# EAGLE schematic test_board (EAGLE 7.5.0)
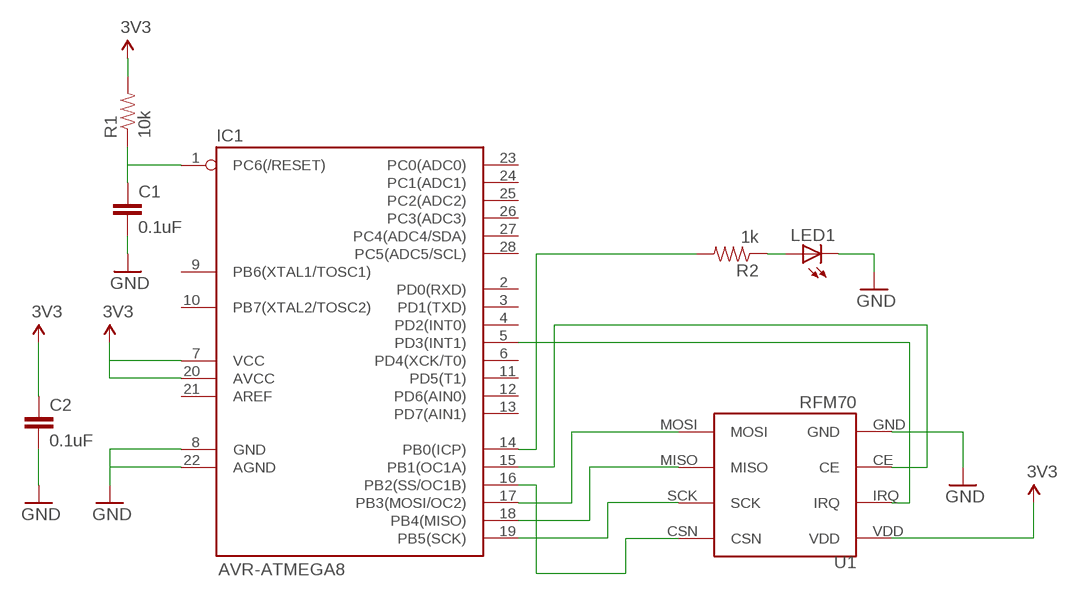
[diagram p0: schematic, sheet 1]

## Parts
C1  0.1uF  0.1UF-25V(+80/-20%)(0603)  [0603-CAP]
C2  0.1uF  0.1UF-25V(+80/-20%)(0603)  [0603-CAP]
IC1  AVR-ATMEGA8  AVR-MEGA8-PPTH  [DIL28-3]
LED1  LED5MM  [LED5MM]
R1  10k  0.75OHM-1/4W-1%(0805)  [0805]
R2  1k  0.75OHM-1/4W-1%(0805)  [0805]
U1  RFM70  [RFM70]

## Nets
GND: C1.2 C2.2 IC1.8(GND) IC1.22(AGND) LED1.K(C) U1.GND
N$1: IC1.17(PB3(MOSI/OC2)) U1.MOSI
N$2: IC1.18(PB4(MISO)) U1.MISO
N$3: IC1.19(PB5(SCK)) U1.SCK
N$4: IC1.15(PB1(OC1A)) U1.CE
N$5: IC1.16(PB2(SS/OC1B)) U1.CSN
N$6: IC1.5(PD3(INT1)) U1.IRQ
N$7: IC1.14(PB0(ICP)) R2.2
N$8: C1.1 IC1.1(PC6(/RESET)) R1.1
N$9: LED1.A R2.1
VCC: C2.1 IC1.7(VCC) IC1.20(AVCC) R1.2 U1.VDD ; supply symbol labelled 3V3
Unconnected: IC1.2(PD0(RXD)) IC1.3(PD1(TXD)) IC1.4(PD2(INT0)) IC1.6(PD4(XCK/T0)) IC1.9(PB6(XTAL1/TOSC1)) IC1.10(PB7(XTAL2/TOSC2)) IC1.11(PD5(T1)) IC1.12(PD6(AIN0)) IC1.13(PD7(AIN1)) IC1.21(AREF) IC1.23(PC0(ADC0)) IC1.24(PC1(ADC1)) IC1.25(PC2(ADC2)) IC1.26(PC3(ADC3)) IC1.27(PC4(ADC4/SDA)) IC1.28(PC5(ADC5/SCL))

## Library data of the parts
C1 C2 = SparkFun-Capacitors:0.1UF-25V(+80/-20%)(0603): CAP-00810 Ceramic Standard decoupling cap; PROD_ID: CAP-00810
IC1 = SparkFun-DigitalIC:AVR-MEGA8-P: MICROCONTROLLER 8 Kbytes FLASH 1 kbytes SRAM 512 bytes EEPROM USART 4-channel 10 bit ADC 2-channel 8 bit ADC
LED1 = adafruit:LED: LED OSRAM: - CHIPLED LG R971, LG N971, LY N971, LG Q971, LY Q971, LO R971, LY R971 LH N974, LH R974 LS Q976, LO Q976, LY Q976 LO Q996 - Hyper CHIPLED LW Q18S LB Q993, LB Q99A, LB R99A - SideLED LS A670, LO A670, LY A670, LG A670, LP A670 LB A673, LV A673, LT A673, LW A673 LH A674 LY A675 LS A676, LA A676, LO A676, LY A676, LW A676 LS A679, LY A679, LG A679 - Hyper Micro SIDELED® LS Y876, LA Y876, LO Y876, LY Y876 LT Y87S - SmartLED LW L88C, LW L88S LB L89C, LB L89S, LG L890 LS L89K, LO L89K, LY L89K LS L896, LA L896, LO L896, LY L896 - TOPLED LS T670, LO T670, LY T670, LG T670, LP T670 LSG T670, LSP T670, LSY T670, LOP T670, LYG T670 LG T671, LOG T671, LSG T671 LB T673, LV T673, LT T673, LW T673 LH T674 LS T676, LA T676, LO T676, LY T676, LB T676, LH T676, LSB T676, LW T676 LB T67C, LV T67C, LT T67C, LS T67K, LO T67K, LY T67K, LW E67C LS E67B, LA E67B, LO E67B, LY E67B, LB E67C, LV E67C, LT E67C LW T67C LS T679, LY T679, LG T679 LS T770, LO T770, LY T770, LG T770, LP T770 LB T773, LV T773, LT T773, LW T773 LH T774 LS E675, LA E675, LY E675, LS T675 LS T776, LA T776, LO T776, LY T776, LB T776 LHGB T686 LT T68C, LB T68C - Hyper Mini TOPLED® LB M676 - Mini TOPLED Santana® LG M470 LS M47K, LO M47K, LY M47K Source: http://www.osram.convergy.de/
R1 R2 = SparkFun-Resistors:0.75OHM-1/4W-1%(0805): RES-08474; PROD_ID: RES-08474; VALUE: 0.75
U1 = RFM70:RFM70: RFM70 short range 2.4GHz RF transceiver module